# Altium schematic sheet power.SchDoc: Power
size A4; Author: Arshia Madadi; CompanyName: SCU - Alzahra; DrawnBy: Arshia Madadi; Organization: Altium Limited; Address1: L3, 12a Rodborough Rd; Address2: Frenchs Forest; Address3: NSW; Address4: Australia 2086; Revision: 0.1; SheetNumber: 1; SheetTotal: 1; Parameter 1: Bordaneh; Project_Name_ENG: Bordaneh; Project_Name_PER: بردانه; linkedin: arshiamadadi; Gmail: ars.madadi@gmail.com; Github: arshiamadadii; Application_BuildNumber: Bordaneh
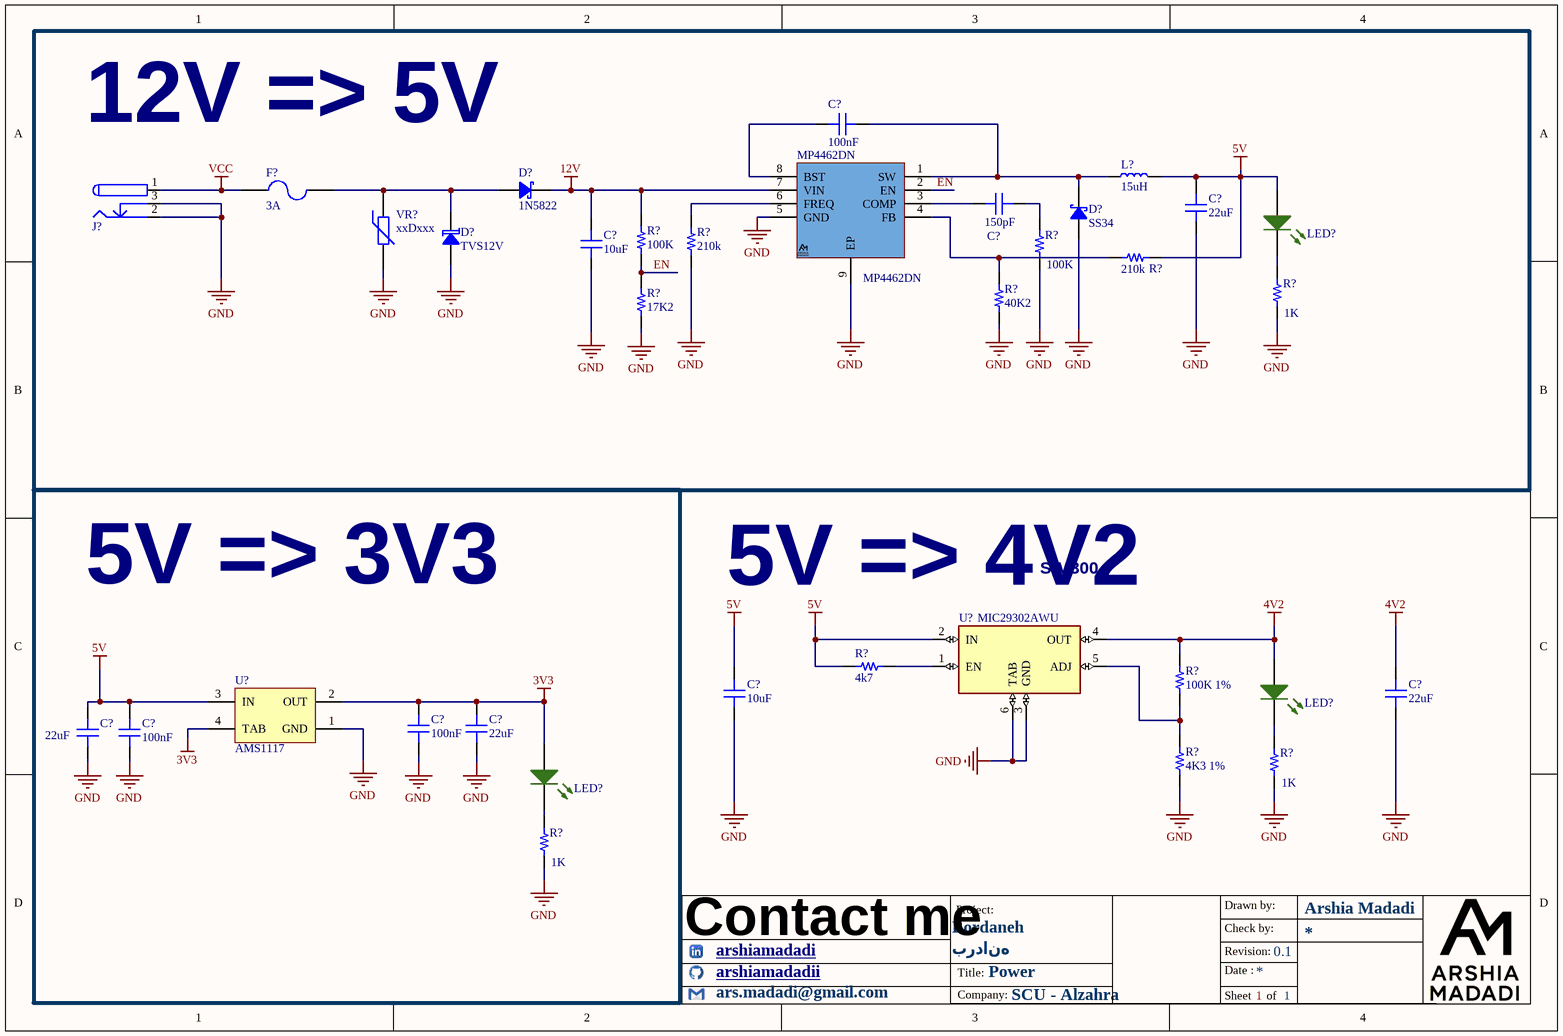
[diagram p0: power.SchDoc]

## Parts
(Parts that share a designator on the sheet are numbered #1, #2 ... from top to bottom, then left to right.)
C?#1  100nF  [CAP 1206_3216 - 1.2MM]
C?#2  150pF  [CAP 1206_3216 - 1.2MM]
C?#3  22uF  [CAP 1206_3216 - 1.2MM]
C?#4  10uF  [CAP 1206_3216 - 1.2MM]
C?#5  10uF  [CAP 1206_3216 - 1.2MM]
C?#6  22uF  [CAP 1206_3216 - 1.2MM]
C?#7  100nF  [CAP 1206_3216 - 1.0MM]
C?#8  22uF  [CAP 1206_3216 - 1.0MM]
C?#9  22uF  [CAP 1206_3216 - 1.0MM]
C?#10  100nF  [CAP 1206_3216 - 1.0MM]
D?#1  1N5822  [DO201 P18MM]
D?#2  SS34  [DO-214AC SMA]
D?#3  TVS12V  [DO-214AA SMB]
F?  value 3A  [FUSE_HOLDER2]  (hidden comment: Fuse)
J?  DC Power Jack  [DC Power Jack 1]  (value not drawn)
L?  15uH  [IND 10X11MM]
LED?#1  LED SMD 1206 GREEN  [LED_1206_GREEN]  (value not drawn)
LED?#2  LED SMD 1206 GREEN  [LED_1206_GREEN]  (value not drawn)
LED?#3  LED SMD 1206 GREEN  [LED_1206_GREEN]  (value not drawn)
MP4462DN  MP4462DN  [MP4462DN]
R?#1  100K  [RES 1206_3216]
R?#2  210k  [RES 1206_3216]
R?#3  100K  [RES 1206_3216]
R?#4  210k  [RES 1206_3216]
R?#5  40K2  [RES 1206_3216]
R?#6  1K  [RES 1206_3216]
R?#7  17K2  [RES 1206_3216]
R?#8  4k7  [RES 1206_3216]
R?#9  100K 1%  [RES 1206_3216]
R?#10  4K3 1%  [RES 1206_3216]
R?#11  1K  [RES 1206_3216]
R?#12  1K  [RES 1206_3216]
U?#1  MIC29302AWU  [TO263-5]
U?#2  AMS1117  [SOT223_M]
VR?  xxDxxx  [07D XXX]

## Blocks framed on the sheet
12V => 5V: C?#1-C?#4 D?#1-D?#3 F? J? L? LED?#1 MP4462DN R?#1-R?#7 VR?
5V => 3V3: C?#7-C?#10 LED?#3 R?#12 U?#2

## Nets
3V3: C?#7.2 C?#8.2 LED?#3.1(A) U?#2.2(OUT) U?#2.4(TAB)
4V2: C?#6.2 LED?#2.1(A) R?#9.2 U?#1.4(OUT)
5V: C?#3.2 C?#5.2 C?#9.2 C?#10.2 L?.2 LED?#1.1(A) R?#4.2 R?#8.2 U?#1.2(IN) U?#2.3(IN)
12V: C?#4.2 D?#1.2 MP4462DN.7(VIN) R?#1.2
GND: C?#3.1 C?#4.1 C?#5.1 C?#6.1 C?#7.1 C?#8.1 C?#9.1 C?#10.1 D?#2.1 D?#3.1 J?.2 J?.3 MP4462DN.5(GND) MP4462DN.9(EP) R?#2.1 R?#3.1 R?#5.1 R?#6.1 R?#7.1 R?#10.1 R?#11.1 R?#12.1 U?#1.3(GND) U?#1.6(TAB) U?#2.1(GND) VR?.2
VCC: F?.1 J?.1
EN: MP4462DN.2(EN) R?#1.1 R?#7.2
NetC?#1_1: C?#1.1 MP4462DN.8(BST)
NetC?#1_2: C?#1.2 D?#2.2 L?.1 MP4462DN.1(SW)
NetC?#2_1: C?#2.1 R?#3.2
NetC?#2_2: C?#2.2 MP4462DN.3(COMP)
NetD?#1_1: D?#1.1 D?#3.2 F?.2 VR?.1
NetLED?#1_2: LED?#1.2(K) R?#6.2
NetLED?#2_2: LED?#2.2(K) R?#11.2
NetLED?#3_2: LED?#3.2(K) R?#12.2
NetMP4462DN_4: MP4462DN.4(FB) R?#4.1 R?#5.2
NetMP4462DN_6: MP4462DN.6(FREQ) R?#2.2
NetR?#8_1: R?#8.1 U?#1.1(EN)
NetR?#9_1: R?#9.1 R?#10.2 U?#1.5(ADJ)

## Notes on the sheet
- SIM800
- (near U?#1) 5V => 4V2
- Project:
- Drawn by:
- Contact me
- Title:
- Revision:
- Check by:
- Date :
- Company:
- Sheet
- of

## Library data of the parts
C?#1 C?#7 C?#10 = Cap 1206: SMT Capacitor; VALUE: 100nF
C?#2-C?#6 C?#8 C?#9 = Cap 1206: SMT Capacitor; VALUE: 100nF
D?#1 = 1N5822 (THD): Diode Schottky 40V 3A Through Hole DO-201AD; PartNumber: 1N5822-E3/54
D?#2 = SS36 (SMD SMA): Diode Schottky 40V 3A(SMA); PartNumber: SS36-HF
D?#3 = TVS 12V (SMD SMB): 19.9V Clamp 30.2A Ipp Tvs Diode Surface Mount DO-214AA (SMBJ); PartNumber: SMBJ12CA
F? = Fuse Holder 5X20mm (THD): Fuse Clip 15A 250V 1 Circuit Cartridge Through Hole; PartNumber: 01020071Z  X 2
J? = DC Power Jack: DC Power Jack. Center Pin 2.5mm. Diameter: 5.7mm; Designer: Ali Hafizi; Company: Personal; Project Name: Laser; Adding Date: 10/21/2009
L? = Ind POWER 10X11mm (SMD): SMT Inductor; Value: 15uH
MP4462DN = MP4462DN: Power Supply; Manufacturer_Name: Monolithic Power Systems (MPS); Datasheet Link: http://uk.rs-online.com/web/p/products/9175759; Height: 1.7mm; Manufacturer_Part_Number: MP4462DN; Mouser Part Number: MP4462DN; Mouser Price/Stock: https://www.mouser.com/Search/Refine.aspx?Keyword=946-MP4560DNLF
R?#1-R?#5 R?#7-R?#10 = Res 1206: SMT Resistor; VALUE: 1K
R?#6 R?#11 R?#12 = Res 1206: SMT Resistor; VALUE: 1K
U?#1 = MIC29302AWU: Linear Voltage Regulator IC Positive Adjustable 1 Output 3A TO-263-5; MF: Microchip; SnapEDA_Link: https://www.snapeda.com/parts/MIC29302AWU/Microchip/view-part/?ref=snap; Package: TO-263-5 Microchip; Value: *; MP: MIC29302AWU; Check_prices: https://www.snapeda.com/parts/MIC29302AWU/Microchip/view-part/?ref=eda
U?#2 = AMS1117-x.x: x.x Volt, 800mA Low-Dropout Linear Regulator, 4-pin SOT-223; Designer: Ali Hafizi; Data: 16-12-2016
VR? = VARISTOR (VDR): VARISTORS; Manufacturer: china-canada-philipina; Designer: Abbas Basereh; Models: MOV-VDR-COV; Data: 2017-1-5; Link: digikey.com; VALUE: xxDxxx; PUBLISHER: ABBAS BASEREH